# EAGLE design Universaldimmer (EAGLE 5.04)
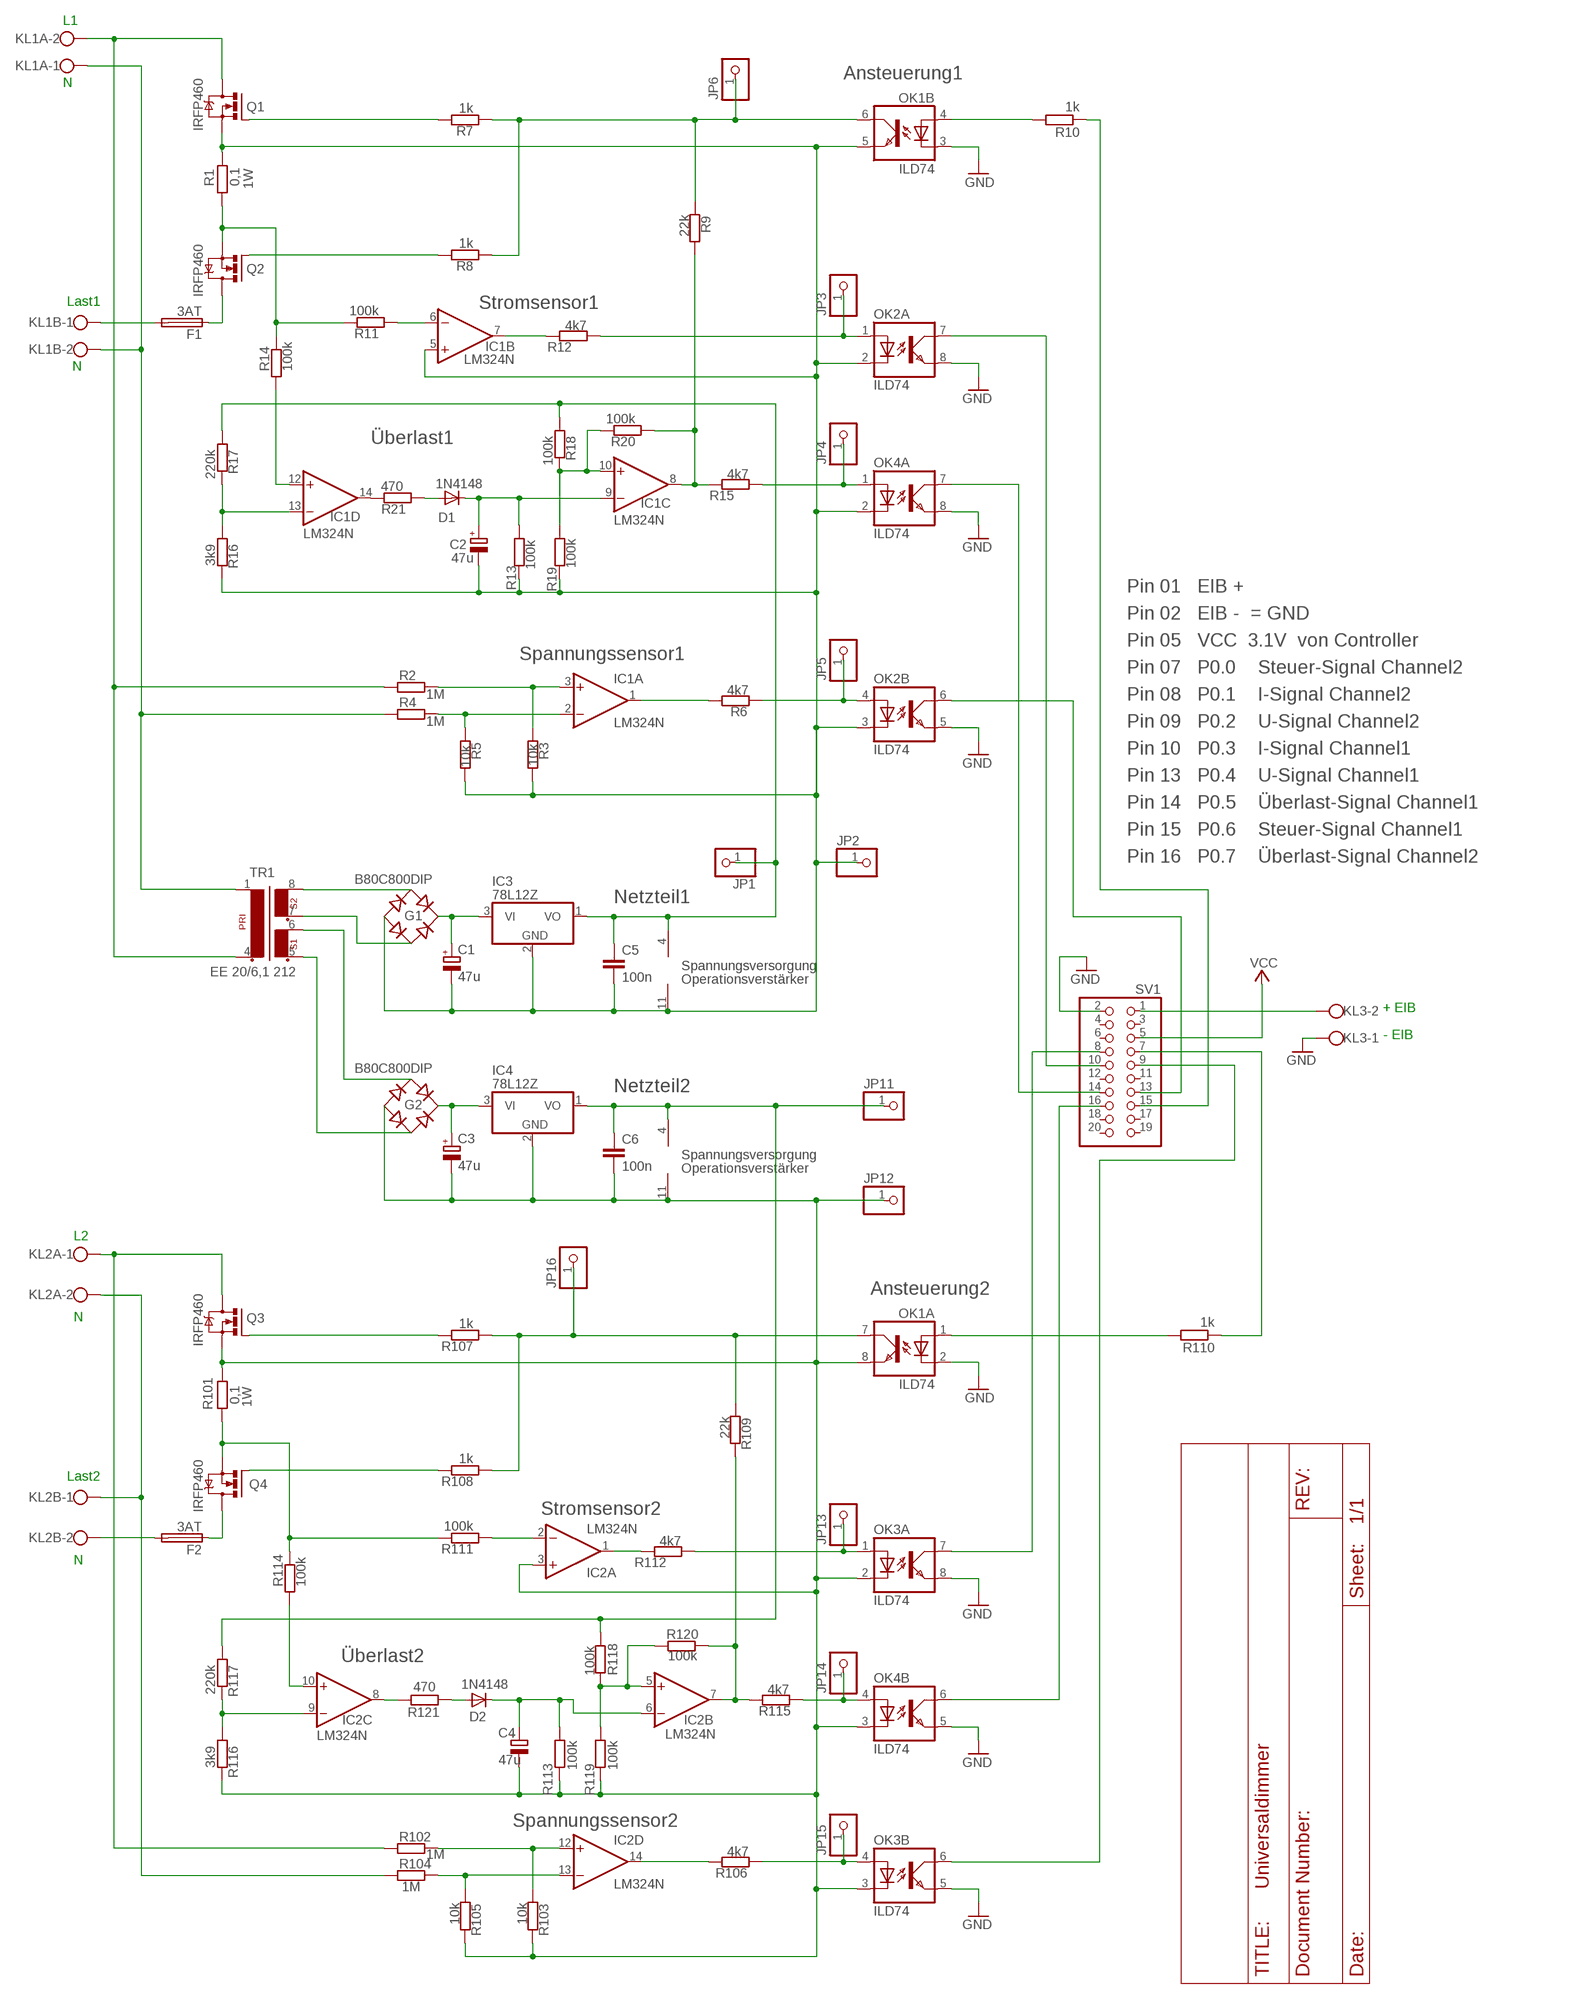
[diagram p0: schematic, sheet 1]

## Parts
C1  47u  CPOL-EUE2-5  [E2-5]
C2  47u  CPOL-EUE2-5  [E2-5]
C3  47u  CPOL-EUE2-5  [E2-5]
C4  47u  CPOL-EUE2-5  [E2-5]
C5  100n  C-EU025-030X050  [C025-030X050]
C6  100n  C-EU025-030X050  [C025-030X050]
D1  1N4148  [D-5]
D2  1N4148  [D-5]
F1  3AT  SH22,5  [SH22,5]
F2  3AT  SH22,5  [SH22,5]
G1  B80C800DIP  RECTIFIER-DIL  [B-DIL]
G2  B80C800DIP  RECTIFIER-DIL  [B-DIL]
IC1  LM324N  [DIL14]
IC2  LM324N  [DIL14]
IC3  78L12Z  [TO92]
IC4  78L12Z  [TO92]
JP1  PINHD-1X1  [1X01]
JP2  PINHD-1X1  [1X01]
JP3  PINHD-1X1  [1X01]
JP4  PINHD-1X1  [1X01]
JP5  PINHD-1X1  [1X01]
JP6  PINHD-1X1  [1X01]
JP11  PINHD-1X1  [1X01]
JP12  PINHD-1X1  [1X01]
JP13  PINHD-1X1  [1X01]
JP14  PINHD-1X1  [1X01]
JP15  PINHD-1X1  [1X01]
JP16  PINHD-1X1  [1X01]
KL1A  W237-102  [W237-102]
KL1B  W237-102  [W237-102]
KL2A  W237-102  [W237-102]
KL2B  W237-102  [W237-102]
KL3  W237-102  [W237-102]
OK1  ILD74  ILD2  [DIL08]
OK2  ILD74  ILD2  [DIL08]
OK3  ILD74  ILD2  [DIL08]
OK4  ILD74  ILD2  [DIL08]
Q1  IRFP460  IRFPC40  [TO247BV]
Q2  IRFP460  IRFPC40  [TO247BV]
Q3  IRFP460  IRFPC40  [TO247BV]
Q4  IRFP460  IRFPC40  [TO247BV]
R1  0,1  R-EU_0309/10  [0309/10]
R2  1M  R-EU_0204/5  [0204/5]
R3  10k  R-EU_0204/5  [0204/5]
R4  1M  R-EU_0204/7  [0204/7]
R5  10k  R-EU_0204/5  [0204/5]
R6  4k7  R-EU_0204/5  [0204/5]
R7  1k  R-EU_0204/7  [0204/7]
R8  1k  R-EU_0204/7  [0204/7]
R9  22k  R-EU_0204/5  [0204/5]
R10  1k  R-EU_0204/7  [0204/7]
R11  100k  R-EU_0204/5  [0204/5]
R12  4k7  R-EU_0204/5  [0204/5]
R13  100k  R-EU_0204/5  [0204/5]
R14  100k  R-EU_0204/5  [0204/5]
R15  4k7  R-EU_0204/5  [0204/5]
R16  3k9  R-EU_0204/5  [0204/5]
R17  220k  R-EU_0204/5  [0204/5]
R18  100k  R-EU_0204/2V  [0204V]
R19  100k  R-EU_0204/2V  [0204V]
R20  100k  R-EU_0204/2V  [0204V]
R21  470  R-EU_0204/2V  [0204V]
R101  0,1  R-EU_0309/10  [0309/10]
R102  1M  R-EU_0204/5  [0204/5]
R103  10k  R-EU_0204/2V  [0204V]
R104  1M  R-EU_0204/7  [0204/7]
R105  10k  R-EU_0204/5  [0204/5]
R106  4k7  R-EU_0204/7  [0204/7]
R107  1k  R-EU_0204/7  [0204/7]
R108  1k  R-EU_0204/7  [0204/7]
R109  22k  R-EU_0204/2V  [0204V]
R110  1k  R-EU_0204/7  [0204/7]
R111  100k  R-EU_0204/7  [0204/7]
R112  4k7  R-EU_0204/7  [0204/7]
R113  100k  R-EU_0204/5  [0204/5]
R114  100k  R-EU_0204/7  [0204/7]
R115  4k7  R-EU_0204/5  [0204/5]
R116  3k9  R-EU_0204/5  [0204/5]
R117  220k  R-EU_0204/2V  [0204V]
R118  100k  R-EU_0204/5  [0204/5]
R119  100k  R-EU_0204/5  [0204/5]
R120  100k  R-EU_0204/5  [0204/5]
R121  470  R-EU_0204/2V  [0204V]
SV1  PINHD-2X10W  [2X10W]
TR1  EE 20/6,1 212  EE20-2  [EE20-2]

## Nets
AGND1: C1.- C2.- C5.2 G1.- IC1.5(B:+IN) IC1.11(P:V-) IC3.2(GND) JP2.1 OK1.5(B:EMIT) OK2.2(A:C) OK2.3(B:C) OK4.2(A:C) Q1.S R1.2 R3.2 R5.2 R13.2 R16.2 R19.2
AGND2: C3.- C4.- C6.2 G2.- IC2.3(A:+IN) IC2.11(P:V-) IC4.2(GND) JP12.1 OK1.8(A:EMIT) OK3.2(A:C) OK3.3(B:C) OK4.3(B:C) Q3.S R101.2 R103.2 R105.2 R113.2 R116.2 R119.2
GND: KL3.1 OK1.2(A:C) OK1.3(B:C) OK2.5(B:EMIT) OK2.8(A:EMIT) OK3.5(B:EMIT) OK3.8(A:EMIT) OK4.5(B:EMIT) OK4.8(A:EMIT) SV1.2
N$1: R10.1 SV1.15
N$2: OK1.4(B:A) R10.2
N$3: KL1A.2 Q1.D R2.1 TR1.4
N$4: Q2.S R1.1 R11.2 R14.2
N$5: OK2.6(B:COL) SV1.13
N$6: IC1.8(C:OUT) R9.2 R15.2 R20.1
N$7: OK2.7(A:COL) SV1.10
N$8: F1.1 Q2.D
N$9: Q2.G R8.2
N$10: OK1.1(A:A) R110.2
N$11: IC1.12(D:+IN) R14.1
N$12: G1.AC1 TR1.8
N$13: JP5.1 OK2.4(B:A) R6.1
N$14: IC2.7(B:OUT) R109.2 R115.2 R120.2
N$15: IC1.1(A:OUT) R6.2
N$16: IC1.6(B:-IN) R11.1
N$17: Q1.G R7.2
N$18: F1.2 KL1B.1
N$19: C1.+ G1.+ IC3.3(VI)
N$20: KL3.2 SV1.1
N$21: IC1.13(D:-IN) R16.1 R17.2
N$22: G1.AC2 TR1.7
N$23: IC1.3(A:+IN) R2.2 R3.1
N$24: IC1.2(A:-IN) R4.2 R5.1
N$25: IC1.14(D:OUT) R21.2
N$27: IC1.7(B:OUT) R12.2
N$28: JP3.1 OK2.1(A:A) R12.1
N$29: F2.2 KL2B.2
N$30: C2.+ D1.C IC1.9(C:-IN) R13.1
N$31: JP6.1 OK1.6(B:COL) R7.1 R8.1 R9.1
N$32: JP4.1 OK4.1(A:A) R15.1
N$33: OK4.7(A:COL) SV1.14
N$34: IC1.10(C:+IN) R18.2 R19.1 R20.2
N$36: JP16.1 OK1.7(A:COL) R107.1 R108.1 R109.1
N$37: F2.1 Q4.D
N$38: Q4.S R101.1 R111.2 R114.2
N$39: KL2A.1 Q3.D R102.1
N$40: Q4.G R108.2
N$42: KL2A.2 KL2B.1 R104.1
N$43: IC2.12(D:+IN) R102.2 R103.1
N$44: IC2.13(D:-IN) R104.2 R105.1
N$45: JP15.1 OK3.4(B:A) R106.1
N$46: IC2.14(D:OUT) R106.2
N$47: IC2.1(A:OUT) R112.2
N$48: JP13.1 OK3.1(A:A) R112.1
N$49: G2.AC2 TR1.5
N$50: OK3.6(B:COL) SV1.9
N$51: OK3.7(A:COL) SV1.8
N$52: R110.1 SV1.7
N$53: Q3.G R107.2
N$54: IC2.2(A:-IN) R111.1
N$55: G2.AC1 TR1.6
N$56: C3.+ G2.+ IC4.3(VI)
N$57: IC2.10(C:+IN) R114.1
N$58: IC2.9(C:-IN) R116.1 R117.2
N$59: IC2.8(C:OUT) R121.2
N$60: C4.+ D2.C IC2.6(B:-IN) R113.1
N$61: JP14.1 OK4.4(B:A) R115.1
N$62: OK4.6(B:COL) SV1.16
N$63: KL1A.1 KL1B.2 R4.1 TR1.1
N$64: D1.A R21.1
N$65: D2.A R121.1
N$66: IC2.5(B:+IN) R118.2 R119.1 R120.1
V12-C1: C5.1 IC1.4(P:V+) IC3.1(VO) JP1.1 R17.1 R18.1
V12-C2: C6.1 IC2.4(P:V+) IC4.1(VO) JP11.1 R117.1 R118.1
VCC: SV1.5
Unconnected: SV1.3 SV1.4 SV1.6 SV1.11 SV1.12 SV1.17 SV1.18 SV1.19 SV1.20

## Notes on the sheet
- L1
- Ansteuerung1
- N
- 1W
- Last1 | Stromsensor1
- N
- Überlast1
- Pin 01   EIB +
- Pin 02   EIB -  = GND
- Pin 05   VCC  3.1V  von Controller
- Spannungssensor1
- Pin 07   P0.0    Steuer-Signal Channel2
- Pin 08   P0.1    I-Signal Channel2
- Pin 09   P0.2    U-Signal Channel2
- Pin 10   P0.3    I-Signal Channel1
- Pin 13   P0.4    U-Signal Channel1
- Pin 14   P0.5    Überlast-Signal Channel1
- Pin 15   P0.6    Steuer-Signal Channel1
- Pin 16   P0.7    Überlast-Signal Channel2
- Netzteil1
- Spannungsversorgung
- Operationsverstärker
- + EIB
- - EIB
- Netzteil2
- Spannungsversorgung
- Operationsverstärker
- L2
- Ansteuerung2
- N
- 1W
- Last2
- Stromsensor2
- N
- Überlast2
- Spannungssensor2

## Library data of the parts
C1-C4 = rcl:CPOL-EU: POLARIZED CAPACITOR, European symbol
C5 C6 = rcl:C-EU: CAPACITOR, European symbol
D1 D2 = diode:1N4148: DIODE high speed (Philips)
F1 F2 = fuse:SH22,5: FUSE HOLDER grid 22,5 mm, OGN0031 8201, Schurter (Buerklin)
G1 G2 = rectifier:RECTIFIER-: Rectifier
IC1 IC2 = linear:LM324: OP AMP
IC3 IC4 = linear:78*: Positive VOLTAGE REGULATOR Source: http://cache.national.com/ds/LM/LM78L05.pdf http://www.fairchildsemi.com/ds/LM/LM7805.pdf
JP1-JP6 JP11-JP16 = pinhead:PINHD-1X1: PIN HEADER
KL1A KL1B KL2A KL2B KL3 = con-wago-500:W237-102: WAGO SCREW CLAMP
OK1-OK4 = optocoupler:ILD2: SIEMENS OPTO COUPLER
Q1-Q4 = transistor-power:IRFPC40: N-CHANNEL MOS FET
R1-R21 R101-R121 = rcl:R-EU_: RESISTOR, European symbol
SV1 = pinhead:PINHD-2X10: PIN HEADER
TR1 = trafo:EE20-2: TRANSFORMER 1 primary winding, 2 secondary windings ERA

## Board
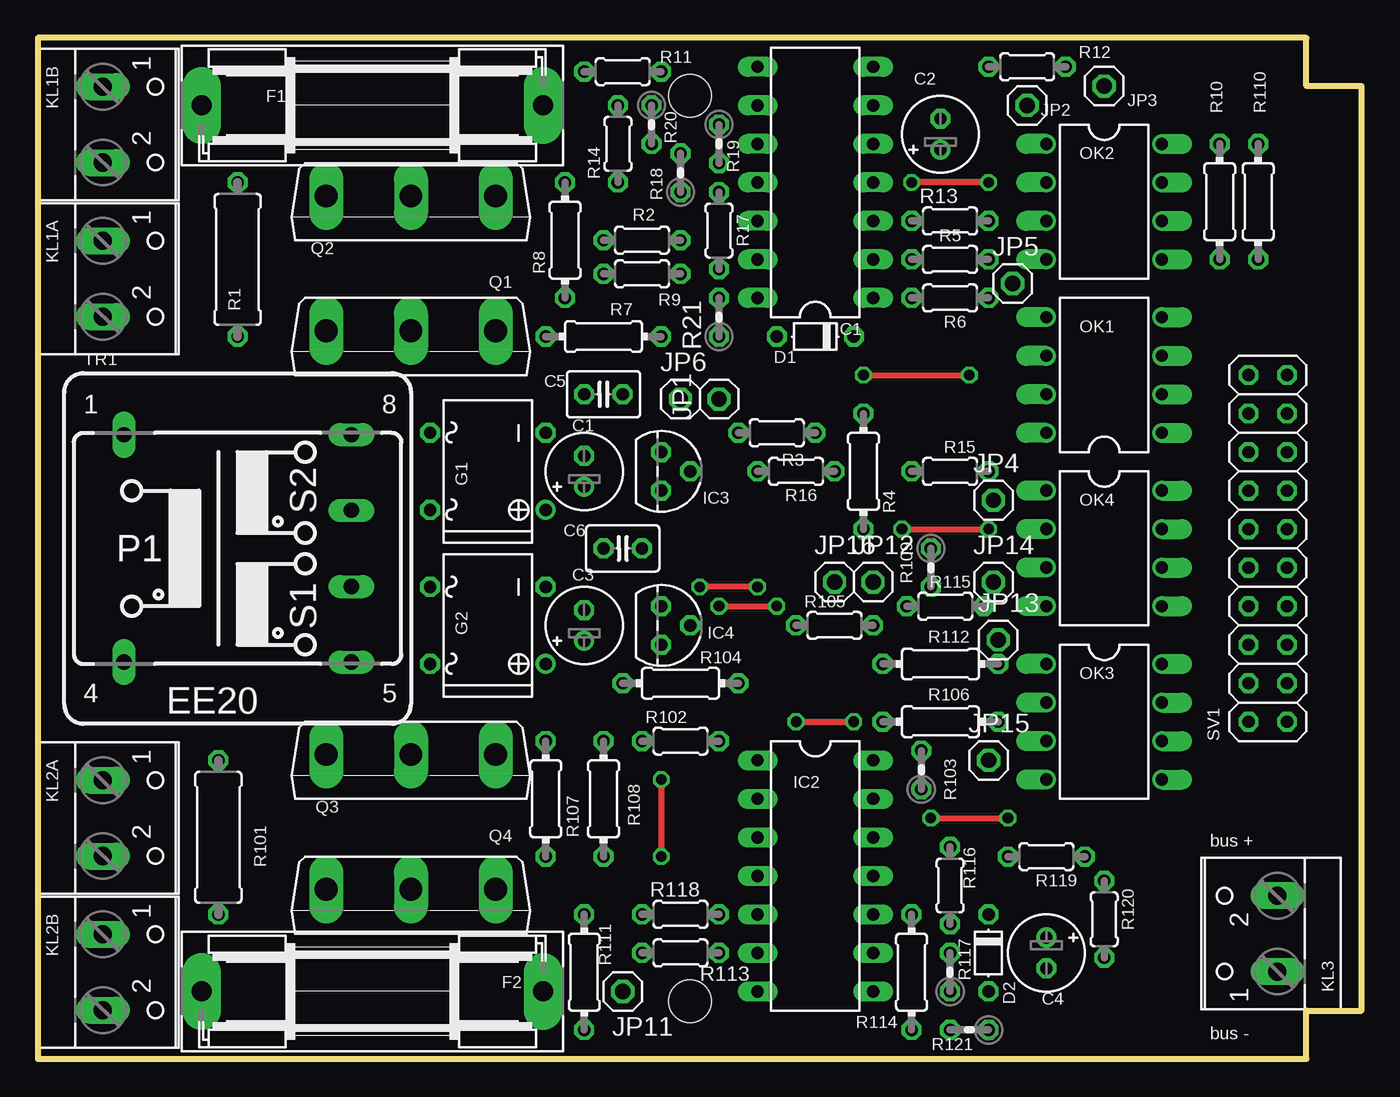
[diagram p1: board, top side]
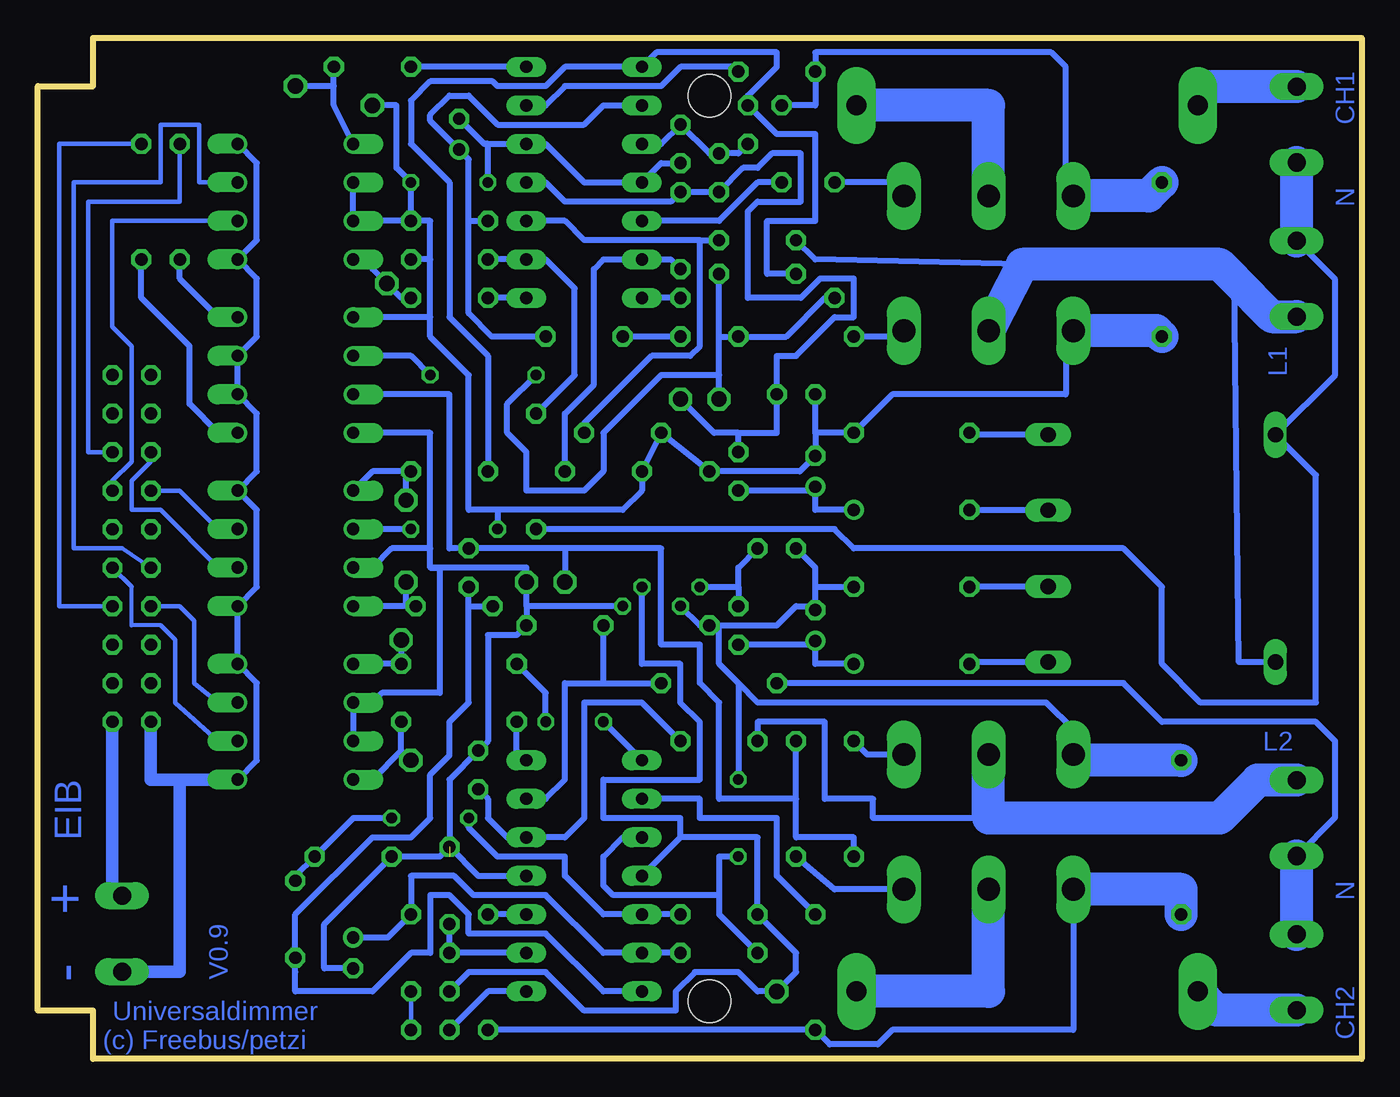
[diagram p2: board, bottom side, seen from below]

Size 87.3 x 67.31 mm. Coordinates in mm from the lower left corner, seen from the top.
Outline: 0,0.01 83.66,0 83.66,3.18 87.3,3.18 87.3,64.13 83.66,64.13 83.66,67.31 0,67.31 0,0.01
Copper layers (1*16): Top 0.035mm / dielectric 1.5mm / Bottom 0.035mm
Design rules "default *": minimum track width 10mil, minimum drill 24mil, track to track 16mil, track to pad 16mil, pad to pad 16mil, via to via 16mil, smd to smd 8mil, copper to edge 10mil, drill to drill 10mil, minimum pad ring 10mil, minimum via ring 8mil, stop-mask expansion 4mil, vias tented up to drill 0mil, thermal gap 10mil
Holes 2.8 mm at 43.02,3.81 43.02,63.5

### Footprints (pad centres in the part's own frame; a part is rotated, then mirrored left to right if it is on the bottom)
E2-5 = drill 0.813 pad 1.27 round: + -1.016,0 | drill 0.813 pad 1.27 octagon: - 1.016,0
C025-030X050 = drill 0.813 octagon: 1 -1.27,0; 2 1.27,0
D-5 = drill 0.813 octagon: A 2.54,0; C -2.54,0
SH22,5 = drill 1.321 pad 2.54 long: 1 -11.252,0; 2 11.252,0
B-DIL = drill 0.813 round: + -2.54,-3.81 | drill 0.813 octagon: - 2.54,-3.81; AC1 2.54,3.81; AC2 -2.54,3.81
DIL14 = drill 0.813 long: 1 -7.62,-3.81; 2 -5.08,-3.81; 3 -2.54,-3.81; 4 0,-3.81; 5 2.54,-3.81; 6 5.08,-3.81; 7 7.62,-3.81; 8 7.62,3.81; 9 5.08,3.81; 10 2.54,3.81; 11 0,3.81; 12 -2.54,3.81; 13 -5.08,3.81; 14 -7.62,3.81
TO92 = drill 0.813 octagon: 1 -1.27,0; 2 0,1.905; 3 1.27,0
1X01 = drill 1.016 octagon: 1 0,0
W237-102 = drill 1.194 long: 1 -2.5,-1.27; 2 2.5,-1.27
DIL08 = drill 0.813 offset: 1 -3.81,-3.81; 2 -1.27,-3.81; 3 1.27,-3.81; 4 3.81,-3.81; 5 3.81,3.81; 6 1.27,3.81; 7 -1.27,3.81; 8 -3.81,3.81
TO247BV = drill 1.499 long: D 0,-2.921; G -5.588,-2.921; S 5.588,-2.921
0309/10 = drill 0.813 octagon: 1 -5.08,0; 2 5.08,0
0204/5 = drill 0.813 octagon: 1 -2.54,0; 2 2.54,0
0204/7 = drill 0.813 octagon: 1 -3.81,0; 2 3.81,0
0204V = drill 0.813 octagon: 1 -1.27,0; 2 1.27,0
2X10W = drill 0.8 octagon: 1 -11.43,-1.27; 3 -8.89,-1.27; 4 -8.89,1.27; 5 -6.35,-1.27; 6 -6.35,1.27; 7 -3.81,-1.27; 8 -3.81,1.27; 9 -1.27,-1.27; 10 -1.27,1.27; 11 1.27,-1.27; 12 1.27,1.27; 13 3.81,-1.27; 14 3.81,1.27; 15 6.35,-1.27; 16 6.35,1.27; 17 8.89,-1.27; 18 8.89,1.27; 19 11.43,-1.27; 20 11.43,1.27 | drill 0.8 pad 1.27 octagon: 2 -11.43,1.27
EE20-2 = drill 1.016 long: 1 -7.493,7.493; 4 -7.493,-7.493; 5 7.493,-7.493; 6 7.493,-2.515; 7 7.493,2.515; 8 7.493,7.493

### Placement (x,y rotation side)
C1  36.03,38.73 90 top
C2  59.52,60.96 90 top
C3  36.03,28.58 90 top
C4  66.51,6.98 270 top
C5  37.3,43.81 180 top
C6  38.57,33.66 180 top
D1  51.27,47.62 180 top
D2  62.7,6.98 270 top
F1  22.06,62.86 180 top
F2  22.06,4.45 180 top
G1  29.68,38.73 90 top
G2  29.68,28.58 90 top
IC1  51.27,57.78 90 top
IC2  51.27,12.06 270 top
IC3  41.11,38.73 270 top
IC4  41.11,28.58 270 top
JP1  44.92,43.5 90 top
JP2  65.24,62.86 0 top
JP3  70.32,64.14 0 top
JP4  63.02,36.83 0 top
JP5  64.29,51.12 0 top
JP6  42.38,43.5 0 top
JP11  38.57,4.45 0 top
JP12  55.08,31.43 0 top
JP13  63.34,27.62 0 top
JP14  63.02,31.43 0 top
JP15  62.7,19.69 0 top
JP16  52.54,31.43 0 top
KL1A  5.55,51.43 270 top
KL1B  5.55,61.59 270 top
KL2A  5.55,15.88 270 top
KL2B  5.55,5.71 270 top
KL3  80.48,8.26 90 top
OK1  70.32,45.09 90 top
OK2  70.32,56.52 270 top
OK3  70.32,22.23 270 top
OK4  70.32,33.66 270 top
Q1  24.6,45.09 180 top
Q2  24.6,53.98 180 top
Q3  24.6,17.15 180 top
Q4  24.6,8.26 180 top
R1  13.17,52.7 270 top
R2  39.84,53.98 0 top
R3  48.73,41.27 180 top
R4  54.45,38.73 90 top
R5  60.16,52.7 0 top
R6  60.16,50.16 180 top
R7  37.3,47.62 180 top
R8  34.76,53.98 90 top
R9  39.84,51.75 180 top
R10  77.94,56.52 270 top
R11  38.57,65.09 180 top
R12  65.24,65.41 180 top
R13  60.16,55.24 0 top
R14  38.25,60.32 90 top
R15  60.16,38.73 180 top
R16  50,38.73 180 top
R17  44.92,54.61 270 top
R18  42.38,58.42 90 top
R19  44.92,60.32 270 top
R20  40.48,61.59 270 top
R21  44.92,48.89 90 top
R101  11.9,14.61 90 top
R102  42.38,20.96 0 top
R103  58.25,19.05 90 top
R104  42.38,24.77 0 top
R105  52.54,28.58 0 top
R106  59.52,22.23 180 top
R107  33.49,17.15 90 top
R108  37.3,17.15 270 top
R109  58.89,32.38 270 top
R110  80.48,56.52 270 top
R111  36.03,5.71 270 top
R112  59.52,26.04 180 top
R113  42.38,6.98 180 top
R114  57.62,5.71 270 top
R115  59.84,29.85 180 top
R116  60.16,11.43 90 top
R117  60.16,5.71 90 top
R118  42.38,9.53 0 top
R119  66.51,13.33 180 top
R120  70.32,9.21 270 top
R121  61.43,1.91 180 top
SV1  81.11,33.66 90 top
TR1  13.17,33.66 0 top

### Tracks (layer width: path | path; a pad name or v marks a point on that pad's centre or on a via)
AGND1  (via drill 0.7)
  Top 0.406: v56.98,34.92 v62.7,34.92 | v62.7,57.78 v57.62,57.78
  Bottom 0.406: 36.03,41.27 G1.- 30.95,43.81 19.52,43.81 19.52,47.5 19.01,47.5 Q1.S | 36.03,41.27 C1.- 37.05,38.73 IC3.2 R3.2 R16.2 47.46,37.46 48.73,36.2 56.98,36.2 | 36.03,41.27 C5.2 | OK2.2 OK2.3 R13.2 | 61.43,47.62 61.43,48.89 OK1.5 | v62.7,34.92 OK4.2 | 56.98,36.2 v56.98,34.92 | 56.98,36.2 58.89,36.2 58.89,45.09 61.43,47.62 | 61.43,52.7 R5.2 | 61.43,52.7 61.43,55.24 R13.2 | 61.43,47.62 61.43,52.7 | R13.2 v62.7,57.78 63.65,58.74 63.65,62.86 JP2.1 | C2.- 57.87,60.32 57.62,60.32 | 57.62,60.32 IC1.5 53.81,60.32 51.27,57.78 IC1.11 46.19,59.05 R19.2 | v57.62,57.78 57.62,60.32
  Bottom 2.184: R1.2 13.55,48.01 Q1.S
AGND2  (via drill 0.7)  (1 unrouted)
  Top 0.406: v44.92,29.85 v48.73,29.85 | v41.11,18.42 v41.11,13.33
  Bottom 0.406: OK1.8 61.43,41.27 61.43,33.66 | 61.43,32.38 61.43,33.66 | Q3.S 19.01,21.72 20.79,23.5 39.84,23.5 41.11,24.77 | 36.03,31.12 G2.- | 36.03,31.12 C3.- 36.28,29.85 37.3,29.85 38.57,28.58 42.38,28.58 | C6.2 36.03,32.38 36.03,31.12 | 42.38,28.58 IC4.2 43.65,28.58 v44.92,29.85 | 41.11,24.77 42.38,26.04 42.38,28.58 | 55.08,29.85 R105.2 55.71,27.94 57.62,27.94 57.62,20.96 R103.2 60.16,18.42 R116.2 | 61.43,32.38 55.08,32.38 JP12.1 55.08,29.85 | OK3.3 OK3.2 65.24,23.5 64.61,24.13 60.8,24.13 60.8,32.38 61.43,32.38 | v48.73,29.85 55.08,29.85 | OK4.3 65.24,32.38 63.97,33.66 61.43,33.66 | C4.- 68.41,5.97 68.41,8.89 R119.2 60.8,13.33 R116.2 | IC2.3 48.73,14.61 50,13.33 50,11.43 49.37,10.79 42.38,10.79 | 41.11,24.77 v41.11,18.42 | v41.11,13.33 42.38,13.33 42.38,10.79 | R113.2 42.38,9.53 42.38,10.79 | IC2.11 58.25,12.06 R116.2
  Bottom 2.184: R101.2 19.01,19.69 Q3.S
GND
  Bottom 0.406: OK2.8 72.86,59.05 72.86,53.98 OK2.5 72.86,51.43 72.86,47.62 OK1.3 OK1.2 72.86,42.54 72.86,38.73 OK4.8 72.86,36.2 72.86,31.12 OK4.5 OK3.8 72.86,24.77 72.86,19.69 OK3.5
  Bottom 0.813: KL3.1 77.94,5.75 77.94,18.42 | 77.94,18.42 OK3.5 | 77.94,18.42 79.84,18.42 SV1.2
N$1
  Bottom 0.305: R10.1 77.94,56.52 83.97,56.52 83.97,40 SV1.15
N$2
  Bottom 0.406: OK1.4 75.4,48.89 77.94,51.43 R10.2
N$3
  Bottom 0.406: TR1.4 8.09,26.16 8.41,51.43 | 22.38,52.39 36.03,52.7 R2.1
  Bottom 2.184: Q1.D 22.38,52.39 9.36,52.39 8.41,51.43 5.91,48.93 KL1A.2
N$4
  Bottom 0.406: Q2.S 19.52,57.4 19.52,65.41 20.47,66.36 36.03,66.36 | 36.03,66.36 R11.2 | 36.03,66.36 36.03,62.86 R14.2
  Bottom 2.184: R1.1 14.06,56.9 Q2.S
N$5
  Bottom 0.305: SV1.13 82.39,38.1 81.11,39.37 81.11,46.99 82.39,48.26 82.39,55.24 OK2.6
N$6
  Bottom 0.406: R9.2 39.2,51.75 39.2,55.24 36.03,55.24 36.03,60.96 38.57,60.96 R20.1 40.48,63.5 38.57,65.41 38.57,66.36 46.51,66.36 IC1.8 52.54,65.41 53.81,64.14 56.98,64.14 57.3,64.45 61.43,64.45 62.7,63.18 62.7,60.32 60.16,57.78 60.16,48.89 57.62,46.35 R15.2
N$7
  Bottom 0.305: SV1.10 81.75,33.66 84.92,33.66 84.92,57.78 79.21,57.78 79.21,61.59 76.67,61.59 76.67,57.78 OK2.7
N$8
  Bottom 2.184: F1.1 24.6,62.86 Q2.D
N$9
  Bottom 0.406: R8.2 31.08,57.78 Q2.G
N$10
  Bottom 0.406: OK1.1 75.4,41.27 77.3,43.18 77.3,46.99 80.48,50.16 R110.2
N$11
  Bottom 0.406: IC1.12 42.38,55.24 39.84,57.78 R14.1
N$12
  Bottom 0.406: TR1.8 25.87,41.15 G1.AC1
N$13
  Bottom 0.406: OK2.4 65.24,52.7 65.24,52.07 JP5.1 63.65,50.48 63.34,50.16 R6.1
N$14
  Bottom 0.406: IC2.7 50,4.45 53.81,8.26 58.89,8.26 58.89,9.53 60.16,10.79 61.43,10.79 61.43,6.98 62.7,6.98 65.24,4.45 70.32,4.45 70.32,5.71 | 58.89,29.85 R115.2 | 70.32,5.71 70.32,9.53 65.24,14.61 62.7,14.61 61.43,15.88 61.43,18.73 60.16,20 60.16,22.23 58.89,23.5 58.89,29.85 | 58.89,29.85 R109.2 | 70.32,5.71 R120.2
N$15
  Bottom 0.406: IC1.1 R6.2
N$16
  Bottom 0.406: IC1.6 53.81,62.86 52.54,64.14 46.19,64.14 44.92,65.41 41.43,65.41 R11.1
N$17
  Bottom 0.406: R7.2 30.57,47.62 Q1.G
N$18
  Bottom 2.184: KL1B.1 10.81,64.09 F1.2
N$19
  Bottom 0.406: G1.+ 36.03,36.2 C1.+ 36.03,37.46 IC3.3
N$20
  Bottom 0.813: KL3.2 82.39,10.75 | 82.39,10.75 82.75,10.75 | 82.39,10.75 SV1.1
N$21
  Bottom 0.406: R16.1 52.54,42.54 50.63,44.45 50.63,52.07 50,52.7 IC1.13 45.55,52.7 R17.2
N$22
  Bottom 0.406: TR1.7 25.87,36.17 G1.AC2
N$23
  Bottom 0.406: 43.65,53.98 R2.2 | 43.65,53.98 51.27,53.98 52.54,55.24 IC1.3 | R3.1 51.27,41.91 46.82,46.35 44.28,46.35 43.65,46.99 43.65,53.98
N$24
  Bottom 0.406: R5.1 IC1.2 53.81,52.7 51.91,50.8 51.91,45.09 R4.2
N$25
  Bottom 0.406: R21.2 IC1.14
N$27
  Bottom 0.406: IC1.7 R12.2
N$28
  Bottom 0.406: OK2.1 67.78,62.86 67.78,64.14 | 67.78,64.14 R12.1 | 67.78,64.14 JP3.1
N$29
  Bottom 2.184: KL2B.2 9.58,3.21 F2.2
N$30
  Bottom 0.406: D1.C 57.37,47.62 58.89,49.15 58.89,55.24 | 58.89,55.24 R13.1 | IC1.9 50,62.86 51.27,61.59 56.98,61.59 58.89,63.5 60.16,63.5 61.43,62.23 61.43,61.85 C2.+ 58.89,59.31 58.89,55.24
N$31  (via drill 0.7)
  Top 0.406: v54.45,45.09 v61.43,45.09
  Bottom 0.406: R8.1 35.39,50.16 37.94,47.62 R7.1 42.38,47.62 | OK1.6 62.7,46.35 v61.43,45.09 | 42.38,47.62 R9.1 | v54.45,45.09 56.35,43.18 56.35,41.27 55.08,40 55.08,37.46 51.27,37.46 50,38.73 50,41.27 46.19,45.09 42.38,45.09 JP6.1 42.38,47.62
N$32
  Bottom 0.406: OK4.1 65.24,38.73 R15.1 63.02,38.42 JP4.1
N$33
  Bottom 0.305: 75.4,34.92 77.94,37.46 SV1.14
  Bottom 0.406: OK4.7 75.4,34.92
N$34
  Bottom 0.406: IC1.10 46.19,60.32 R19.1 43.02,59.69 R18.2 41.11,59.69 R20.2
N$36
  Bottom 0.406: OK1.7 60.16,43.81 60.16,33.66 R109.1 52.54,33.66 | R107.1 33.49,14.61 37.3,14.61 37.3,17.15 | 37.3,17.15 42.38,17.15 42.38,23.5 43.65,24.77 43.65,27.31 46.19,27.31 46.19,33.66 52.54,33.66 | 52.54,33.66 JP16.1 | 37.3,17.15 R108.1
N$37
  Bottom 2.184: F2.1 24.6,4.45 Q4.D
N$38
  Bottom 0.406: R114.2 R111.2 35.08,0.95 31.9,0.95 30.95,1.91 19.01,1.91 Q4.S
  Bottom 2.184: Q4.S 11.9,11.18 R101.1
N$39
  Bottom 0.406: 24.6,15.88 32.22,15.88 32.22,17.15 35.39,17.15 35.39,22.23 39.84,22.23 R102.1
  Bottom 2.184: Q3.D 24.6,15.88 9.36,15.88 6.86,18.38 KL2A.1
N$40
  Bottom 0.406: Q4.G 34.76,11.18 R108.2
N$42
  Bottom 0.406: KL2A.2 1.74,15.91 1.74,20.96 3.01,22.23 13.17,22.23 15.71,24.77 R104.1
  Bottom 2.184: KL2B.1 KL2A.2
N$43
  Bottom 0.406: R102.2 47.46,23.5 51.27,23.5 51.27,15.88 52.54,14.61 IC2.12 56.35,14.61 57.62,15.88 57.62,17.15 R103.1
N$44
  Bottom 0.406: IC2.13 53.81,17.15 52.54,18.42 52.54,24.77 50,24.77 | 50,24.77 R104.2 | 50,24.77 R105.1
N$45
  Bottom 0.406: OK3.4 65.24,18.42 63.34,20.32 | 63.34,20.32 R106.1 | JP15.1 63.34,20.32
N$46
  Bottom 0.406: R106.2 55.71,20.32 IC2.14
N$47  (via drill 0.7)
  Top 0.406: v50,22.23 v53.81,22.23
  Bottom 0.406: IC2.1 v50,22.23 | R112.2 53.81,24.13 v53.81,22.23
N$48
  Bottom 0.406: OK3.1 R112.1 JP13.1
N$49
  Bottom 0.406: TR1.5 25.87,26.16 G2.AC2
N$50
  Bottom 0.254: 79.21,28.58 81.11,28.58 81.11,31.12
  Bottom 0.305: 75.4,20.96 78.26,23.5 78.26,27.62 79.21,28.58 | 81.11,31.12 SV1.9
  Bottom 0.406: OK3.6 75.4,20.96
N$51
  Bottom 0.305: 75.4,23.5 76.99,24.77 76.99,28.89 77.94,29.85 SV1.8
  Bottom 0.406: OK3.7 75.4,23.5
N$52
  Bottom 0.305: R110.1 85.88,60.32 85.88,29.85 SV1.7
N$53
  Bottom 0.406: R107.2 32.6,20.07 Q3.G
N$54
  Bottom 0.406: IC2.2 43.65,17.15 43.65,15.88 38.57,15.88 38.57,12.06 R111.1
N$55
  Bottom 0.406: TR1.6 25.87,31.14 G2.AC1
N$56
  Bottom 0.406: G2.+ 36.03,26.04 C3.+ 36.28,27.31 IC4.3
N$57
  Bottom 0.406: IC2.10 R114.1
N$58
  Bottom 0.406: IC2.9 R117.2 R116.1
N$59
  Bottom 0.406: IC2.8 57.62,4.45 R121.2
N$60
  Bottom 0.406: C4.+ 64.22,8 D2.C 62.7,12.06 59.84,12.06 58.57,10.79 53.81,10.79 50,6.98 IC2.6 R113.1
N$61
  Bottom 0.406: R115.1 63.02,29.85 | 63.02,29.85 OK4.4 | 63.02,29.85 JP14.1
N$62
  Bottom 0.305: 75.4,32.38 79.21,36.2 81.11,36.2 81.11,38.1 79.84,39.37 SV1.16
  Bottom 0.406: OK4.6 75.4,32.38
N$63
  Bottom 0.406: TR1.1 5.68,41.27 | KL1A.1 1.74,51.39 1.74,45.09 TR1.1 | TR1.1 3.01,38.48 3.01,23.5 10.63,23.5 13.17,26.04 13.17,31.12 15.71,33.66 33.49,33.66 34.76,34.92 R4.1
  Bottom 2.184: KL1A.1 KL1B.2
N$64
  Bottom 0.406: R21.1 D1.A
N$65
  Bottom 0.305: R121.1 D2.A
N$66  (via drill 0.7)
  Top 0.406: v58.89,15.88 v63.97,15.88
  Bottom 0.406: R118.2 IC2.5 50,9.53 52.54,12.06 52.54,13.33 56.98,13.33 58.89,15.24 v58.89,15.88 | v63.97,15.88 66.51,15.88 R119.1 70.32,12.06 R120.1
V12-C1
  Bottom 0.406: IC1.4 53.81,57.78 52.54,56.52 45.55,56.52 R17.1 R18.1 40.79,58.74 39.84,58.74 38.89,59.69 36.98,59.69 36.98,56.52 39.84,56.52 40.48,55.88 40.48,50.16 36.98,50.16 35.71,51.43 33.49,51.43 33.49,48.89 34.76,48.89 37.3,46.35 38.57,46.35 38.57,45.09 | IC3.1 41.11,41.27 | 41.11,41.27 38.57,41.27 C5.1 38.57,45.09 | 38.57,45.09 38.57,45.4 | 41.11,41.27 42.7,41.27 JP1.1
V12-C2  (via drill 0.7)
  Top 0.406: v47.46,31.12 v43.65,31.12
  Bottom 0.406: C6.1 41.11,32.38 41.11,31.12 | 44.92,14.61 IC2.4 | 44.92,14.61 44.92,15.88 50,15.88 50,18.42 43.65,18.42 43.65,22.23 44.92,23.5 44.92,26.04 47.46,26.04 v47.46,31.12 | 41.11,31.12 IC4.1 | v43.65,31.12 41.11,31.12 | 44.92,14.61 39.84,14.61 R118.1 37.3,6.98 37.3,5.71 JP11.1 39.84,4.45 41.11,5.71 43.97,5.71 45.24,4.45 45.24,3.17 51.27,3.17 53.81,5.71 58.89,5.71 R117.1

### Text on the board
Bottom: CH1 | N | L1 | L2 | EIB | N | + | V0.9 | - | Universaldimmer | CH2 | (c) Freebus/petzi
tPlace: bus + | bus -